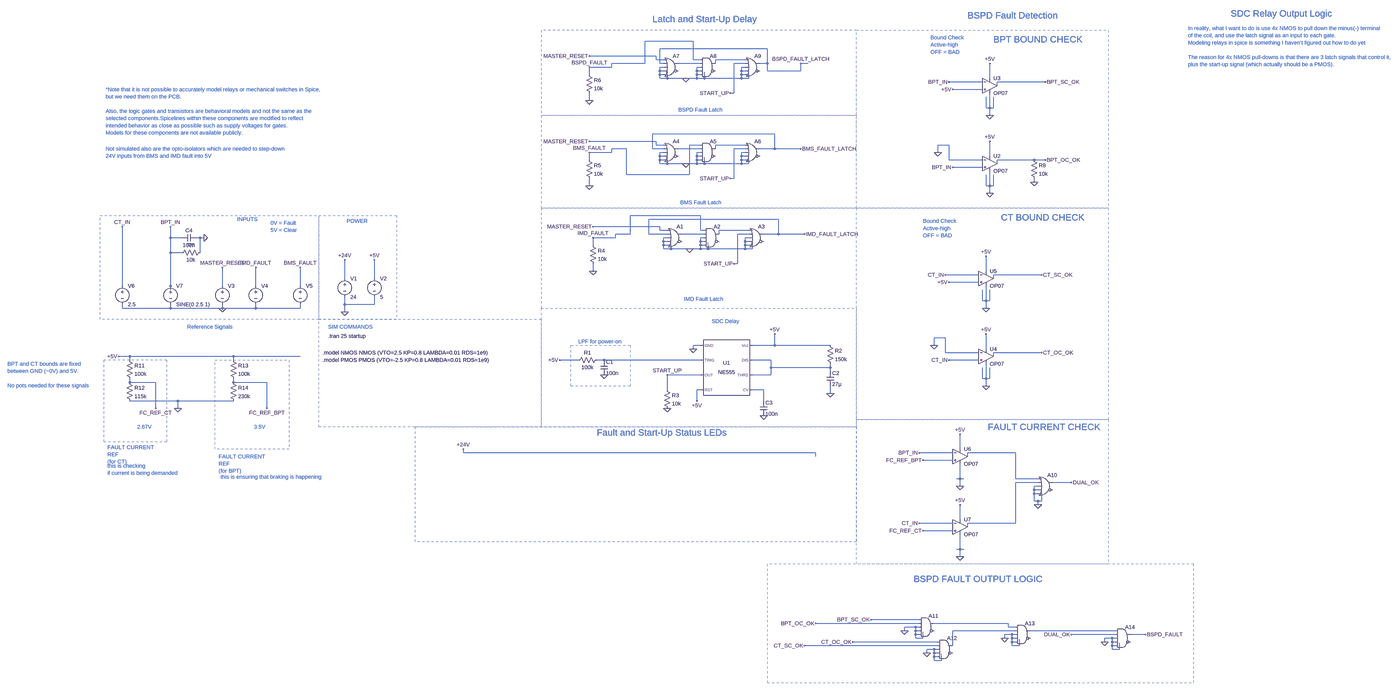
[diagram p0: schematic SDC_FULL_SIM.asc, whole sheet]
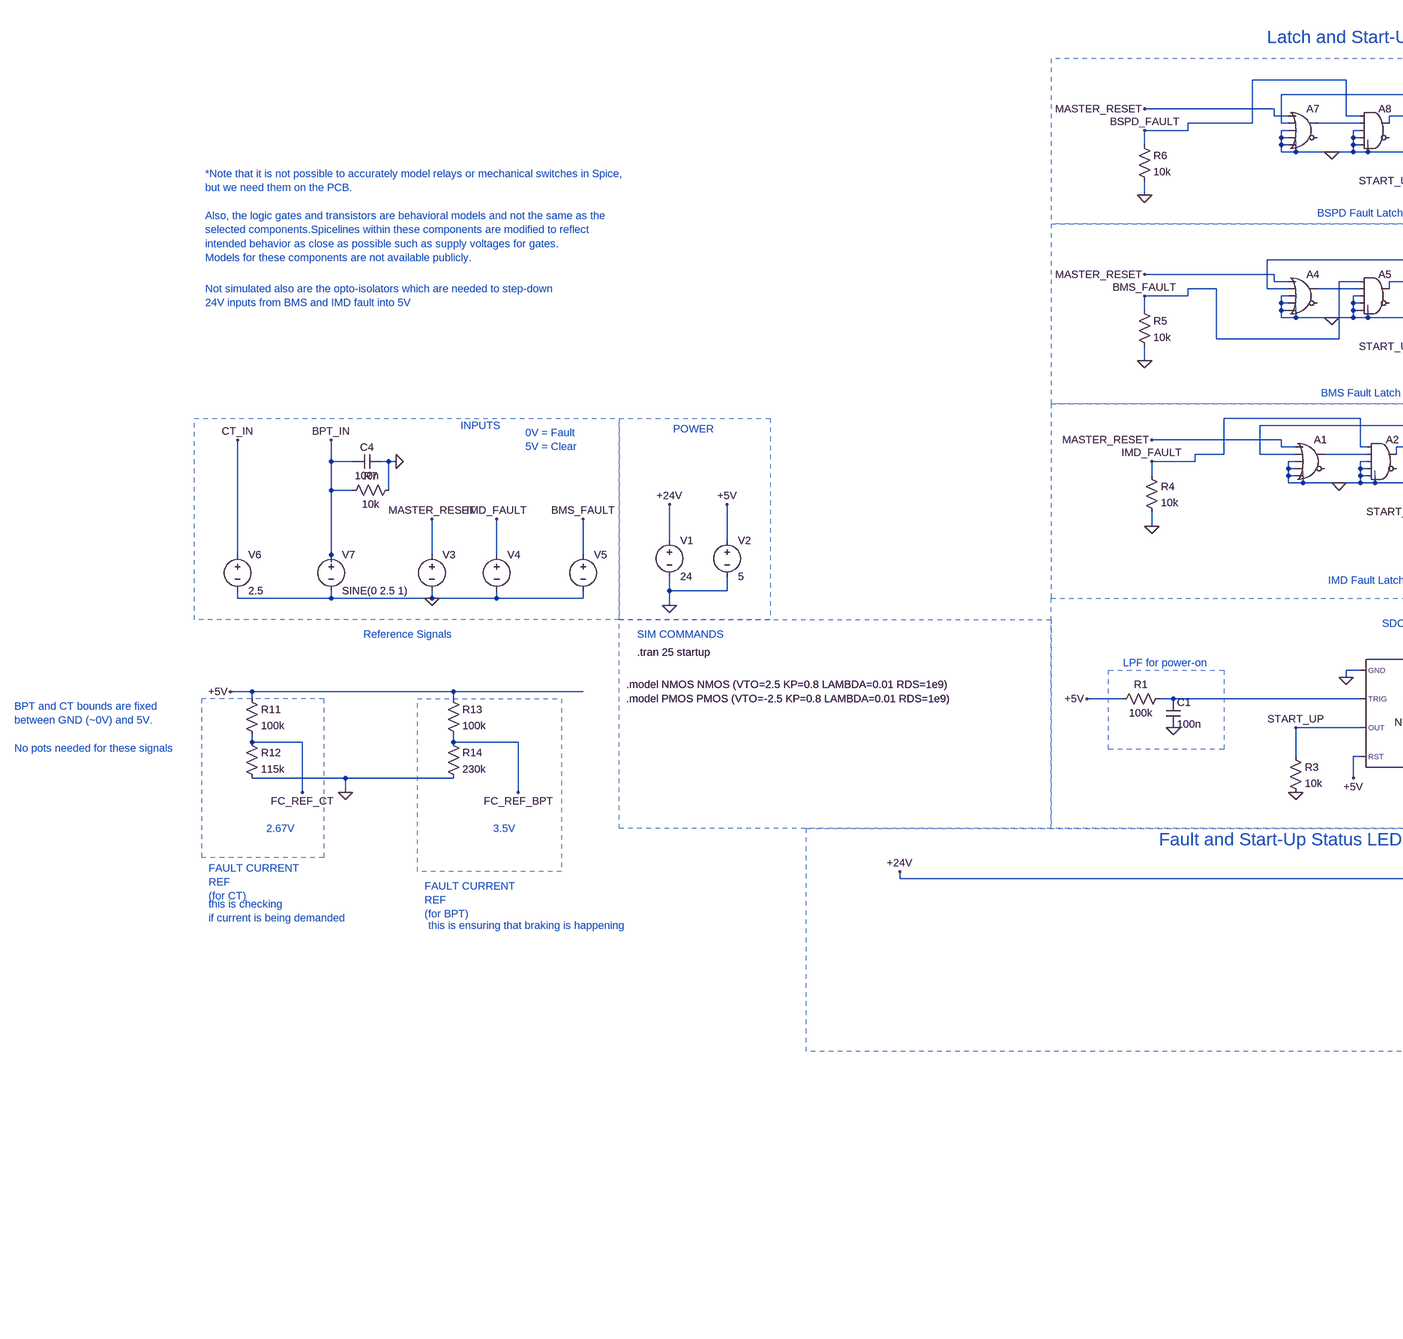
[diagram p1: schematic SDC_FULL_SIM.asc, part, row 1 of 1, column 1 of 2]
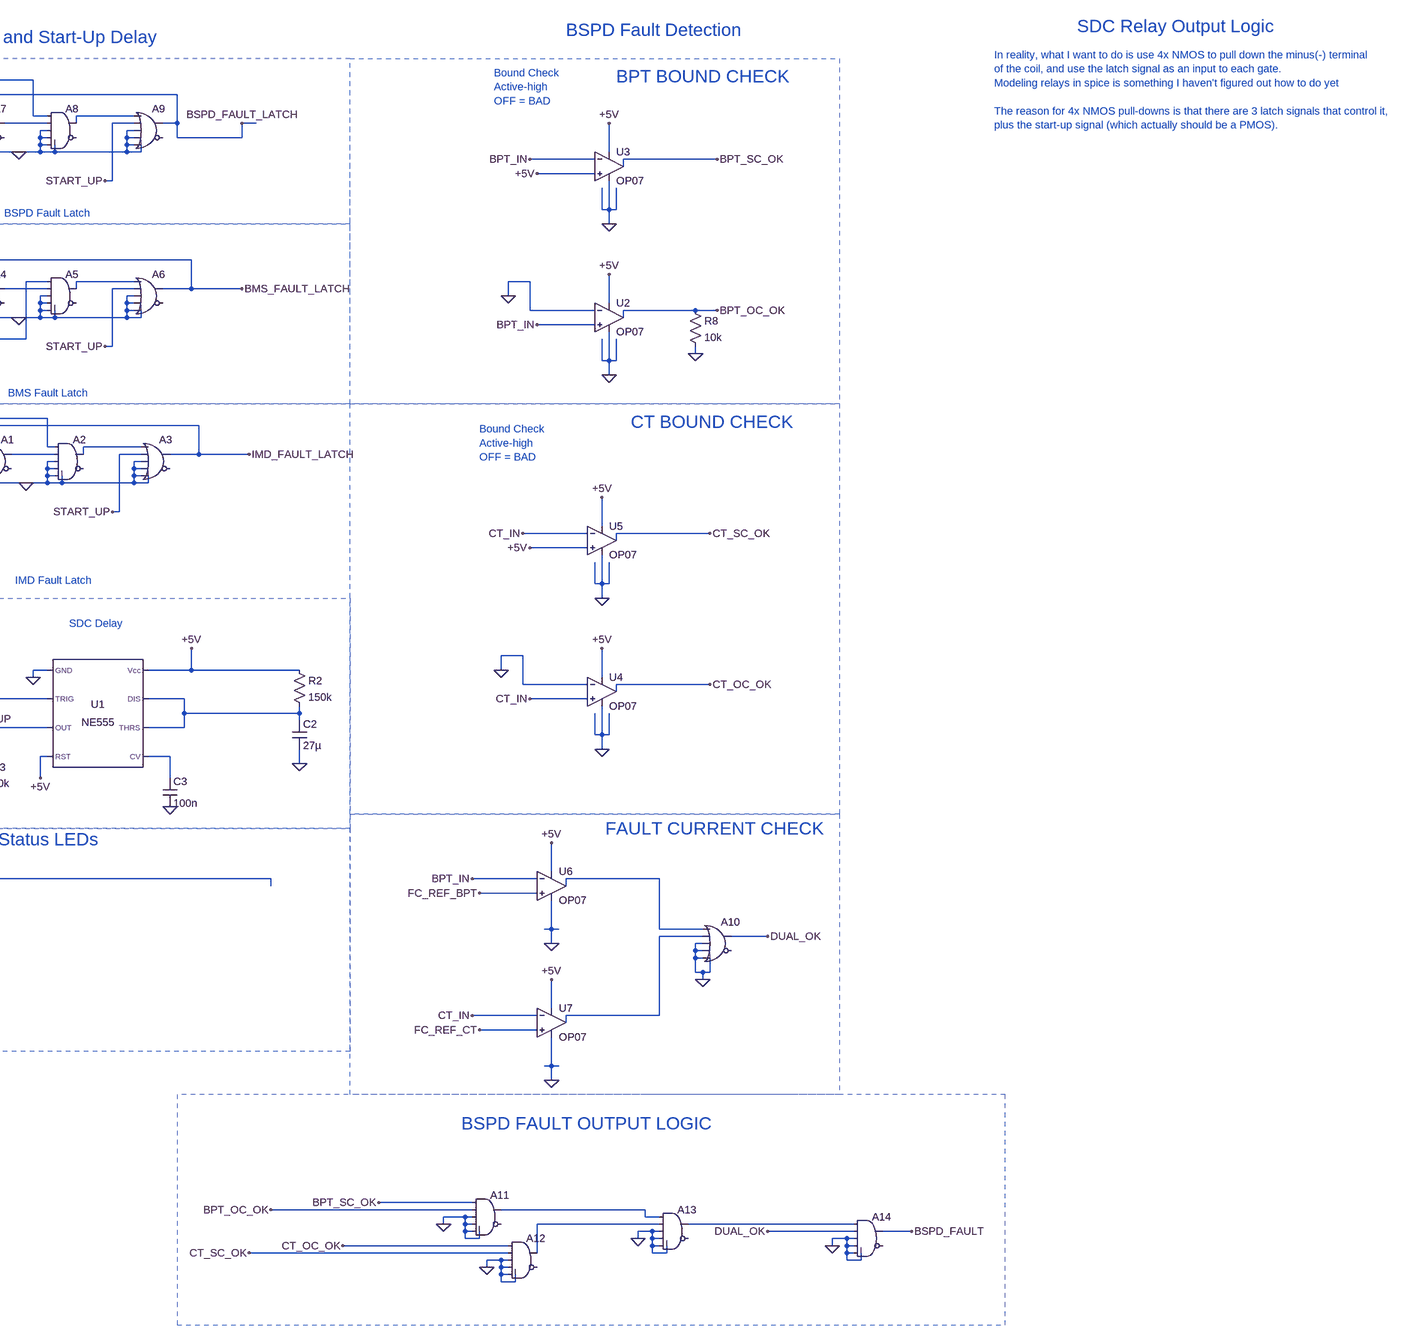
[diagram p2: schematic SDC_FULL_SIM.asc, part, row 1 of 1, column 2 of 2]
SDC_FULL_SIM.asc, the LTspice schematic file:
Version 4
SHEET 1 5196 1940
WIRE 800 -880 592 -880
WIRE 1120 -848 656 -848
WIRE 640 -816 352 -816
WIRE 640 -800 640 -816
WIRE 672 -800 640 -800
WIRE 800 -800 800 -880
WIRE 832 -800 800 -800
WIRE 1024 -800 896 -800
WIRE 592 -784 592 -880
WIRE 592 -784 448 -784
WIRE 656 -784 656 -848
WIRE 672 -784 656 -784
WIRE 832 -784 736 -784
WIRE 896 -784 896 -800
WIRE 1024 -784 976 -784
WIRE 1120 -784 1120 -848
WIRE 1120 -784 1088 -784
WIRE 1296 -784 1264 -784
WIRE 448 -768 448 -784
WIRE 448 -768 352 -768
WIRE 672 -768 656 -768
WIRE 832 -768 816 -768
WIRE 1024 -768 1008 -768
WIRE 656 -752 656 -768
WIRE 672 -752 656 -752
WIRE 816 -752 816 -768
WIRE 832 -752 816 -752
WIRE 1008 -752 1008 -768
WIRE 1024 -752 1008 -752
WIRE 1120 -752 1120 -784
WIRE 1264 -752 1264 -784
WIRE 1264 -752 1120 -752
WIRE 352 -736 352 -768
WIRE 656 -736 656 -752
WIRE 672 -736 656 -736
WIRE 816 -736 816 -752
WIRE 832 -736 816 -736
WIRE 1008 -736 1008 -752
WIRE 1024 -736 1008 -736
WIRE 656 -720 656 -736
WIRE 688 -720 688 -736
WIRE 688 -720 656 -720
WIRE 768 -720 688 -720
WIRE 816 -720 816 -736
WIRE 816 -720 768 -720
WIRE 848 -720 848 -736
WIRE 848 -720 816 -720
WIRE 1008 -720 1008 -736
WIRE 1008 -720 848 -720
WIRE 1040 -720 1040 -736
WIRE 1040 -720 1008 -720
WIRE 2080 -720 2080 -784
WIRE 2048 -704 1904 -704
WIRE 2320 -704 2112 -704
WIRE 2112 -688 2112 -704
WIRE 2048 -672 1920 -672
WIRE 976 -656 976 -784
WIRE 976 -656 960 -656
WIRE 352 -624 352 -656
WIRE 2064 -592 2064 -640
WIRE 2080 -592 2080 -656
WIRE 2080 -592 2064 -592
WIRE 2096 -592 2096 -640
WIRE 2096 -592 2080 -592
WIRE 2080 -560 2080 -592
WIRE 1152 -480 624 -480
WIRE 640 -448 352 -448
WIRE 640 -432 640 -448
WIRE 672 -432 640 -432
WIRE 832 -432 784 -432
WIRE 1024 -432 896 -432
WIRE 1904 -432 1856 -432
WIRE 512 -416 448 -416
WIRE 624 -416 624 -480
WIRE 672 -416 624 -416
WIRE 832 -416 736 -416
WIRE 896 -416 896 -432
WIRE 1024 -416 976 -416
WIRE 1152 -416 1152 -480
WIRE 1152 -416 1088 -416
WIRE 1264 -416 1152 -416
WIRE 448 -400 448 -416
WIRE 448 -400 352 -400
WIRE 672 -400 656 -400
WIRE 832 -400 816 -400
WIRE 1024 -400 1008 -400
WIRE 1856 -400 1856 -432
WIRE 656 -384 656 -400
WIRE 672 -384 656 -384
WIRE 816 -384 816 -400
WIRE 832 -384 816 -384
WIRE 1008 -384 1008 -400
WIRE 1024 -384 1008 -384
WIRE 2080 -384 2080 -448
WIRE 352 -368 352 -400
WIRE 656 -368 656 -384
WIRE 672 -368 656 -368
WIRE 816 -368 816 -384
WIRE 832 -368 816 -368
WIRE 1008 -368 1008 -384
WIRE 1024 -368 1008 -368
WIRE 1904 -368 1904 -432
WIRE 2048 -368 1904 -368
WIRE 2272 -368 2112 -368
WIRE 2320 -368 2272 -368
WIRE 656 -352 656 -368
WIRE 688 -352 688 -368
WIRE 688 -352 656 -352
WIRE 768 -352 688 -352
WIRE 816 -352 816 -368
WIRE 816 -352 768 -352
WIRE 848 -352 848 -368
WIRE 848 -352 816 -352
WIRE 1008 -352 1008 -368
WIRE 1008 -352 848 -352
WIRE 1040 -352 1040 -368
WIRE 1040 -352 1008 -352
WIRE 2112 -352 2112 -368
WIRE 2048 -336 1920 -336
WIRE 512 -304 512 -416
WIRE 784 -304 784 -432
WIRE 784 -304 512 -304
WIRE 976 -288 976 -416
WIRE 976 -288 960 -288
WIRE 2272 -272 2272 -288
WIRE 352 -256 352 -288
WIRE 2064 -256 2064 -304
WIRE 2080 -256 2080 -320
WIRE 2080 -256 2064 -256
WIRE 2096 -256 2096 -304
WIRE 2096 -256 2080 -256
WIRE 2080 -224 2080 -256
WIRE 832 -128 528 -128
WIRE 1168 -112 608 -112
WIRE 656 -80 368 -80
WIRE 656 -64 656 -80
WIRE 688 -64 656 -64
WIRE 832 -64 832 -128
WIRE 848 -64 832 -64
WIRE 1040 -64 912 -64
WIRE 528 -48 528 -128
WIRE 528 -48 464 -48
WIRE 608 -48 608 -112
WIRE 688 -48 608 -48
WIRE 848 -48 752 -48
WIRE 912 -48 912 -64
WIRE 1040 -48 992 -48
WIRE 1168 -48 1168 -112
WIRE 1168 -48 1104 -48
WIRE 1280 -48 1168 -48
WIRE -1456 -32 -1456 -80
WIRE -1408 -32 -1456 -32
WIRE -1328 -32 -1344 -32
WIRE -1312 -32 -1328 -32
WIRE 464 -32 464 -48
WIRE 464 -32 368 -32
WIRE 688 -32 672 -32
WIRE 848 -32 832 -32
WIRE 1040 -32 1024 -32
WIRE 672 -16 672 -32
WIRE 688 -16 672 -16
WIRE 832 -16 832 -32
WIRE 848 -16 832 -16
WIRE 1024 -16 1024 -32
WIRE 1040 -16 1024 -16
WIRE 368 0 368 -32
WIRE 672 0 672 -16
WIRE 688 0 672 0
WIRE 832 0 832 -16
WIRE 848 0 832 0
WIRE 1024 0 1024 -16
WIRE 1040 0 1024 0
WIRE 672 16 672 0
WIRE 704 16 704 0
WIRE 704 16 672 16
WIRE 784 16 704 16
WIRE 832 16 832 0
WIRE 832 16 784 16
WIRE 864 16 864 0
WIRE 864 16 832 16
WIRE 1024 16 1024 0
WIRE 1024 16 864 16
WIRE 1056 16 1056 0
WIRE 1056 16 1024 16
WIRE -1456 32 -1456 -32
WIRE -1408 32 -1456 32
WIRE -1328 32 -1328 -32
WIRE 992 80 992 -48
WIRE 992 80 976 80
WIRE 368 112 368 80
WIRE 2064 112 2064 48
WIRE 2032 128 1888 128
WIRE 2304 128 2096 128
WIRE -704 144 -704 64
WIRE -576 144 -576 64
WIRE 2096 144 2096 128
WIRE 2032 160 1904 160
WIRE -1664 176 -1664 -80
WIRE -1456 176 -1456 32
WIRE -1232 176 -1232 96
WIRE -1088 176 -1088 96
WIRE -896 176 -896 96
WIRE -1456 192 -1456 176
WIRE 2048 240 2048 192
WIRE 2064 240 2064 176
WIRE 2064 240 2048 240
WIRE 2080 240 2080 192
WIRE 2080 240 2064 240
WIRE -704 256 -704 224
WIRE -576 256 -576 224
WIRE -576 256 -704 256
WIRE -1664 272 -1664 256
WIRE -1456 272 -1456 256
WIRE -1456 272 -1664 272
WIRE -1232 272 -1232 256
WIRE -1232 272 -1456 272
WIRE -1088 272 -1088 256
WIRE -1088 272 -1232 272
WIRE -896 272 -896 256
WIRE -896 272 -1088 272
WIRE 2064 272 2064 240
WIRE -704 288 -704 256
WIRE 1888 400 1840 400
WIRE 832 432 800 432
WIRE 1152 432 1152 384
WIRE 1152 432 1056 432
WIRE 1392 432 1152 432
WIRE 1840 432 1840 400
WIRE 800 448 800 432
WIRE 2064 448 2064 384
WIRE 1888 464 1888 400
WIRE 2032 464 1888 464
WIRE 2304 464 2096 464
WIRE -1632 480 -1680 480
WIRE -1184 480 -1632 480
WIRE -896 480 -1184 480
WIRE 2096 480 2096 464
WIRE -1632 496 -1632 480
WIRE -1184 496 -1184 480
WIRE 304 496 224 496
WIRE 416 496 384 496
WIRE 832 496 416 496
WIRE 1136 496 1056 496
WIRE 2032 496 1904 496
WIRE 1136 528 1136 496
WIRE 1392 528 1392 512
WIRE 1392 528 1136 528
WIRE 1392 544 1392 528
WIRE 832 560 688 560
WIRE 1136 560 1136 528
WIRE 1136 560 1056 560
WIRE 2048 576 2048 528
WIRE 2064 576 2064 512
WIRE 2064 576 2048 576
WIRE 2080 576 2080 528
WIRE 2080 576 2064 576
WIRE -1632 592 -1632 576
WIRE -1520 592 -1632 592
WIRE -1184 592 -1184 576
WIRE -1040 592 -1184 592
WIRE 2064 608 2064 576
WIRE 688 624 688 560
WIRE 832 624 816 624
WIRE 1104 624 1056 624
WIRE 1392 640 1392 608
WIRE -1424 672 -1632 672
WIRE -1184 672 -1424 672
WIRE 816 672 816 624
WIRE 1104 672 1104 624
WIRE -1520 704 -1520 592
WIRE -1424 704 -1424 672
WIRE -1040 704 -1040 592
WIRE 1952 880 1952 816
WIRE -192 896 -192 880
WIRE 1328 896 -192 896
WIRE 1920 896 1776 896
WIRE 2192 896 1984 896
WIRE 1328 912 1328 896
WIRE 1984 912 1984 896
WIRE 1920 928 1792 928
WIRE 1952 1008 1952 944
WIRE 1952 1008 1936 1008
WIRE 1968 1008 1952 1008
WIRE 2192 1008 2192 896
WIRE 2288 1008 2192 1008
WIRE 2288 1024 2192 1024
WIRE 2432 1024 2352 1024
WIRE 1952 1040 1952 1008
WIRE 2288 1040 2272 1040
WIRE 2272 1056 2272 1040
WIRE 2288 1056 2272 1056
WIRE 2272 1072 2272 1056
WIRE 2288 1072 2272 1072
WIRE 2272 1104 2272 1072
WIRE 2288 1104 2272 1104
WIRE 2304 1104 2304 1072
WIRE 2304 1104 2288 1104
WIRE 2288 1120 2288 1104
WIRE 1952 1184 1952 1120
WIRE 1920 1200 1776 1200
WIRE 2192 1200 2192 1024
WIRE 2192 1200 1984 1200
WIRE 1984 1216 1984 1200
WIRE 1920 1232 1792 1232
WIRE 1952 1312 1952 1248
WIRE 1952 1312 1936 1312
WIRE 1968 1312 1952 1312
WIRE 1952 1344 1952 1312
WIRE 1776 1616 1568 1616
WIRE 1776 1632 1328 1632
WIRE 2160 1632 1840 1632
WIRE 1760 1648 1712 1648
WIRE 1776 1648 1760 1648
WIRE 2160 1648 2160 1632
WIRE 2192 1648 2160 1648
WIRE 1712 1664 1712 1648
WIRE 1760 1664 1760 1648
WIRE 1776 1664 1760 1664
WIRE 2192 1664 1920 1664
WIRE 2624 1664 2256 1664
WIRE 1760 1680 1760 1664
WIRE 1776 1680 1760 1680
WIRE 2176 1680 2144 1680
WIRE 2192 1680 2176 1680
WIRE 2624 1680 2432 1680
WIRE 2752 1680 2688 1680
WIRE 1760 1696 1760 1680
WIRE 1792 1696 1792 1680
WIRE 1792 1696 1760 1696
WIRE 2144 1696 2144 1680
WIRE 2176 1696 2176 1680
WIRE 2192 1696 2176 1696
WIRE 2608 1696 2576 1696
WIRE 2624 1696 2608 1696
WIRE 1856 1712 1488 1712
WIRE 2176 1712 2176 1696
WIRE 2192 1712 2176 1712
WIRE 2576 1712 2576 1696
WIRE 2608 1712 2608 1696
WIRE 2624 1712 2608 1712
WIRE 1856 1728 1280 1728
WIRE 1920 1728 1920 1664
WIRE 2176 1728 2176 1712
WIRE 2208 1728 2208 1712
WIRE 2208 1728 2176 1728
WIRE 2608 1728 2608 1712
WIRE 2624 1728 2608 1728
WIRE 1840 1744 1808 1744
WIRE 1856 1744 1840 1744
WIRE 2608 1744 2608 1728
WIRE 2640 1744 2640 1728
WIRE 2640 1744 2608 1744
WIRE 1808 1760 1808 1744
WIRE 1840 1760 1840 1744
WIRE 1856 1760 1840 1760
WIRE 1840 1776 1840 1760
WIRE 1856 1776 1840 1776
WIRE 1840 1792 1840 1776
WIRE 1872 1792 1872 1776
WIRE 1872 1792 1840 1792
FLAG -704 288 0
FLAG -704 64 +24V
FLAG -576 64 +5V
FLAG 800 448 0
FLAG 416 560 0
FLAG 688 560 START_UP
FLAG 1392 640 0
FLAG 688 704 0
FLAG 1104 736 0
FLAG 368 112 0
FLAG -1232 96 MASTER_RESET
FLAG 368 -32 IMD_FAULT
FLAG -896 96 BMS_FAULT
FLAG -1088 96 IMD_FAULT
FLAG 368 -80 MASTER_RESET
FLAG 976 80 START_UP
FLAG 1280 -48 IMD_FAULT_LATCH
FLAG 784 16 0
FLAG 352 -256 0
FLAG 352 -448 MASTER_RESET
FLAG 960 -288 START_UP
FLAG 768 -352 0
FLAG 352 -400 BMS_FAULT
FLAG 1264 -416 BMS_FAULT_LATCH
FLAG 352 -624 0
FLAG 352 -816 MASTER_RESET
FLAG 960 -656 START_UP
FLAG 768 -720 0
FLAG 352 -768 BSPD_FAULT
FLAG 1264 -784 BSPD_FAULT_LATCH
FLAG -192 880 +24V
FLAG -1456 -80 BPT_IN
FLAG -1664 -80 CT_IN
FLAG -1232 272 0
FLAG -1680 480 +5V
FLAG -1424 704 0
FLAG -1520 704 FC_REF_CT
FLAG 2080 -560 0
FLAG 2080 -784 +5V
FLAG 1904 -704 BPT_IN
FLAG 1920 -672 +5V
FLAG 2320 -704 BPT_SC_OK
FLAG 2080 -224 0
FLAG 2080 -448 +5V
FLAG 1920 -336 BPT_IN
FLAG 2320 -368 BPT_OC_OK
FLAG 1856 -400 0
FLAG 2064 272 0
FLAG 2064 48 +5V
FLAG 1888 128 CT_IN
FLAG 1904 160 +5V
FLAG 2304 128 CT_SC_OK
FLAG 2064 608 0
FLAG 2064 384 +5V
FLAG 1904 496 CT_IN
FLAG 2304 464 CT_OC_OK
FLAG 1840 432 0
FLAG -1040 704 FC_REF_BPT
FLAG 1952 1040 0
FLAG 1952 816 +5V
FLAG 1776 896 BPT_IN
FLAG 1952 1344 0
FLAG 1952 1120 +5V
FLAG 1776 1200 CT_IN
FLAG 1792 928 FC_REF_BPT
FLAG 1792 1232 FC_REF_CT
FLAG 2288 1120 0
FLAG 2432 1024 DUAL_OK
FLAG 1568 1616 BPT_SC_OK
FLAG 1328 1632 BPT_OC_OK
FLAG 1280 1728 CT_SC_OK
FLAG 1488 1712 CT_OC_OK
FLAG 2432 1680 DUAL_OK
FLAG 2752 1680 BSPD_FAULT
FLAG 1712 1664 0
FLAG 1808 1760 0
FLAG 2144 1696 0
FLAG 2576 1712 0
FLAG 816 672 +5V
FLAG 1152 384 +5V
FLAG 224 496 +5V
FLAG -1312 -32 0
FLAG 2272 -272 0
SYMBOL Misc\\NE555 944 528 R0
SYMATTR InstName U1
SYMBOL voltage -704 128 R0
WINDOW 123 0 0 Left 0
WINDOW 39 0 0 Left 0
SYMATTR InstName V1
SYMATTR Value 24
SYMBOL voltage -576 128 R0
WINDOW 123 0 0 Left 0
WINDOW 39 0 0 Left 0
SYMATTR InstName V2
SYMATTR Value 5
SYMBOL res 400 480 R90
WINDOW 0 0 56 VBottom 2
WINDOW 3 32 56 VTop 2
SYMATTR InstName R1
SYMATTR Value 100k
SYMBOL cap 400 496 R0
SYMATTR InstName C1
SYMATTR Value 100n
SYMBOL res 1376 416 R0
SYMATTR InstName R2
SYMATTR Value 150k
SYMBOL cap 1376 544 R0
SYMATTR InstName C2
SYMATTR Value 27µ
SYMBOL res 672 608 R0
SYMATTR InstName R3
SYMATTR Value 10k
SYMBOL cap 1088 672 R0
SYMATTR InstName C3
SYMATTR Value 100n
SYMBOL res 352 -16 R0
SYMATTR InstName R4
SYMATTR Value 10k
SYMBOL Digital\\or 720 -96 R0
SYMATTR InstName A1
SYMATTR SpiceLine Vhigh=5, Vlow=0, Ref= 2.5
SYMBOL Digital\\and 880 -96 R0
SYMATTR InstName A2
SYMATTR SpiceLine Vhigh=5, Vlow=0, Ref= 2.5
SYMBOL Digital\\or 1072 -96 R0
SYMATTR InstName A3
SYMATTR SpiceLine Vhigh=5, Vlow=0, Ref= 2.5
SYMBOL voltage -1232 160 R0
WINDOW 3 -400 -182 Invisible 2
WINDOW 123 0 0 Left 0
WINDOW 39 0 0 Left 0
SYMATTR Value PULSE(0 5 7 0 0 2 30 1)
SYMATTR InstName V3
SYMBOL voltage -896 160 R0
WINDOW 3 -400 -182 Invisible 2
WINDOW 123 0 0 Left 0
WINDOW 39 0 0 Left 0
SYMATTR Value 5
SYMATTR InstName V5
SYMBOL res 336 -384 R0
SYMATTR InstName R5
SYMATTR Value 10k
SYMBOL Digital\\or 704 -464 R0
SYMATTR InstName A4
SYMATTR SpiceLine Vhigh=5, Vlow=0, Ref= 2.5
SYMBOL Digital\\and 864 -464 R0
SYMATTR InstName A5
SYMATTR SpiceLine Vhigh=5, Vlow=0, Ref= 2.5
SYMBOL Digital\\or 1056 -464 R0
SYMATTR InstName A6
SYMATTR SpiceLine Vhigh=5, Vlow=0, Ref= 2.5
SYMBOL res 336 -752 R0
SYMATTR InstName R6
SYMATTR Value 10k
SYMBOL Digital\\or 704 -832 R0
SYMATTR InstName A7
SYMATTR SpiceLine Vhigh=5, Vlow=0, Ref= 2.5
SYMBOL Digital\\and 864 -832 R0
SYMATTR InstName A8
SYMATTR SpiceLine Vhigh=5, Vlow=0, Ref= 2.5
SYMBOL Digital\\or 1056 -832 R0
SYMATTR InstName A9
SYMATTR SpiceLine Vhigh=5, Vlow=0, Ref= 2.5
SYMBOL voltage -1664 160 R0
WINDOW 123 0 0 Left 0
WINDOW 39 0 0 Left 0
SYMATTR InstName V6
SYMATTR Value 2.5
SYMBOL voltage -1456 160 R0
WINDOW 123 0 0 Left 0
WINDOW 39 0 0 Left 0
SYMATTR InstName V7
SYMATTR Value SINE(0 2.5 1)
SYMBOL res -1648 480 R0
SYMATTR InstName R11
SYMATTR Value 100k
SYMBOL res -1648 576 R0
SYMATTR InstName R12
SYMATTR Value 115k
SYMBOL res -1200 480 R0
SYMATTR InstName R13
SYMATTR Value 100k
SYMBOL res -1200 576 R0
SYMATTR InstName R14
SYMATTR Value 230k
SYMBOL Digital\\or 2320 976 R0
SYMATTR InstName A10
SYMATTR SpiceLine Vhigh=5, Vlow=0, Ref= 2.5
SYMBOL Digital\\and 1808 1584 R0
SYMATTR InstName A11
SYMATTR SpiceLine Vhigh=5, Vlow=0, Ref= 2.5
SYMBOL Digital\\and 1888 1680 R0
SYMATTR InstName A12
SYMATTR SpiceLine Vhigh=5, Vlow=0, Ref= 2.5
SYMBOL Digital\\and 2224 1616 R0
SYMATTR InstName A13
SYMATTR SpiceLine Vhigh=5, Vlow=0, Ref= 2.5
SYMBOL Digital\\and 2656 1632 R0
SYMATTR InstName A14
SYMATTR SpiceLine Vhigh=5, Vlow=0, Ref= 2.5
SYMBOL OpAmps\\OP07 1952 1152 R0
SYMATTR InstName U7
SYMBOL OpAmps\\OP07 1952 848 R0
SYMATTR InstName U6
SYMBOL OpAmps\\OP07 2064 416 R0
SYMATTR InstName U4
SYMBOL OpAmps\\OP07 2064 80 R0
SYMATTR InstName U5
SYMBOL OpAmps\\OP07 2080 -416 R0
SYMATTR InstName U2
SYMBOL OpAmps\\OP07 2080 -752 R0
SYMATTR InstName U3
SYMBOL voltage -1088 160 R0
WINDOW 3 -400 -182 Invisible 2
WINDOW 123 0 0 Left 0
WINDOW 39 0 0 Left 0
SYMATTR Value 5
SYMATTR InstName V4
SYMBOL cap -1344 -48 R90
WINDOW 0 0 32 VBottom 2
WINDOW 3 32 32 VTop 2
SYMATTR InstName C4
SYMATTR Value 100n
SYMBOL res -1312 16 R90
WINDOW 0 0 56 VBottom 2
WINDOW 3 32 56 VTop 2
SYMATTR InstName R7
SYMATTR Value 10k
SYMBOL res 2256 -384 R0
SYMATTR InstName R8
SYMATTR Value 10k
TEXT -696 -104 Left 2 ;POWER
TEXT 880 328 Left 2 ;SDC Delay
TEXT -776 352 Left 2 ;SIM COMMANDS
TEXT -776 392 Left 2 !.tran 25 startup
TEXT 304 416 Left 2 ;LPF for power-on
TEXT 760 232 Left 2 ;IMD Fault Latch
TEXT -1168 -112 Left 2 ;INPUTS
TEXT 744 -184 Left 2 ;BMS Fault Latch
TEXT 736 -584 Left 2 ;BSPD Fault Latch
TEXT 624 -976 Left 4 ;Latch and Start-Up Delay
TEXT 1984 -992 Left 4 ;BSPD Fault Detection
TEXT 3120 -1000 Left 4 ;SDC Relay Output Logic
TEXT -1736 -672 Left 2 ;*Note that it is not possible to accurately model relays or mechanical switches in Spice,\nbut we need them on the PCB.\n \nAlso, the logic gates and transistors are behavioral models and not the same as the \nselected components.Spicelines within these components are modified to reflect \nintended behavior as close as possible such as supply voltages for gates. \nModels for these components are not available publicly.
TEXT 384 808 Left 4 ;Fault and Start-Up Status LEDs
TEXT -1384 352 Left 2 ;Reference Signals
TEXT -1728 872 Left 2 ;FAULT CURRENT\nREF\n(for CT)
TEXT -1736 -416 Left 2 ;Not simulated also are the opto-isolators which are needed to step-down\n24V inputs from BMS and IMD fault into 5V
TEXT -2160 512 Left 2 ;BPT and CT bounds are fixed \nbetween GND (~0V) and 5V.\n \nNo pots needed for these signals
TEXT 1824 -896 Left 2 ;Bound Check\nActive-high\nOFF = BAD
TEXT 2096 -888 Left 4 ;BPT BOUND CHECK
TEXT 2128 -120 Left 4 ;CT BOUND CHECK
TEXT -1248 912 Left 2 ;FAULT CURRENT\nREF\n(for BPT)
TEXT -1096 784 Left 2 ;3.5V
TEXT -1600 784 Left 2 ;2.67V
TEXT 2072 784 Left 4 ;FAULT CURRENT CHECK
TEXT 1752 1440 Left 4 ;BSPD FAULT OUTPUT LOGIC
TEXT -800 464 Left 2 !.model NMOS NMOS (VTO=2.5 KP=0.8 LAMBDA=0.01 RDS=1e9)
TEXT -800 496 Left 2 !.model PMOS PMOS (VTO=-2.5 KP=0.8 LAMBDA=0.01 RDS=1e9)
TEXT 2936 -936 Left 2 ;In reality, what I want to do is use 4x NMOS to pull down the minus(-) terminal\nof the coil, and use the latch signal as an input to each gate. \nModeling relays in spice is something I haven't figured out how to do yet\n \nThe reason for 4x NMOS pull-downs is that there are 3 latch signals that control it,\nplus the start-up signal (which actually should be a PMOS).
TEXT -1240 1000 Left 2 ;this is ensuring that braking is happening
TEXT -1728 952 Left 2 ;this is checking \nif current is being demanded
TEXT 1792 -104 Left 2 ;Bound Check\nActive-high\nOFF = BAD
TEXT -1024 -96 Left 2 ;0V = Fault\n5V = Clear
RECTANGLE Normal -480 320 -816 -128 2
RECTANGLE Normal 528 608 272 432 2
RECTANGLE Normal 1504 784 144 272 2
RECTANGLE Normal 1504 -160 144 272 2
RECTANGLE Normal 1504 -560 144 -160 2
RECTANGLE Normal 1504 -928 144 -560 2
RECTANGLE Normal 1504 1280 -400 784 2
RECTANGLE Normal -1760 -128 -816 320 2
RECTANGLE Normal -1744 848 -1472 496 2
RECTANGLE Normal 2592 -160 1504 -928 2
RECTANGLE Normal 2592 752 1504 -160 2
RECTANGLE Normal -944 880 -1264 496 2
RECTANGLE Normal 2592 1376 1504 752 2
RECTANGLE Normal 1120 1888 2960 1376 2
RECTANGLE Normal 144 784 -816 320 2

The netlist it stands for:
* SDC_FULL_SIM.asc
XU1 0 N007 START_UP +5V N009 N008 N008 +5V NE555  ; pins GND TRIG OUT RST CV THRS DIS Vcc
V1 +24V 0 24
V2 +5V 0 5
R1 N007 +5V 100k
C1 N007 0 100n
R2 +5V N008 150k
C2 N008 0 27µ
R3 START_UP 0 10k
C3 N009 0 100n
R4 IMD_FAULT 0 10k
A1 MASTER_RESET IMD_FAULT_LATCH 0 0 0 0 N006 0 OR Vhigh=5, Vlow=0, Ref= 2.5
A2 IMD_FAULT N006 0 0 0 0 N005 0 AND Vhigh=5, Vlow=0, Ref= 2.5
A3 N005 START_UP 0 0 0 0 IMD_FAULT_LATCH 0 OR Vhigh=5, Vlow=0, Ref= 2.5
V3 MASTER_RESET 0 PULSE(0 5 7 0 0 2 30 1)
V5 BMS_FAULT 0 5
R5 BMS_FAULT 0 10k
A4 MASTER_RESET BMS_FAULT_LATCH 0 0 0 0 N004 0 OR Vhigh=5, Vlow=0, Ref= 2.5
A5 BMS_FAULT N004 0 0 0 0 N003 0 AND Vhigh=5, Vlow=0, Ref= 2.5
A6 N003 START_UP 0 0 0 0 BMS_FAULT_LATCH 0 OR Vhigh=5, Vlow=0, Ref= 2.5
R6 BSPD_FAULT 0 10k
A7 MASTER_RESET BSPD_FAULT_LATCH 0 0 0 0 N002 0 OR Vhigh=5, Vlow=0, Ref= 2.5
A8 BSPD_FAULT N002 0 0 0 0 N001 0 AND Vhigh=5, Vlow=0, Ref= 2.5
A9 N001 START_UP 0 0 0 0 BSPD_FAULT_LATCH 0 OR Vhigh=5, Vlow=0, Ref= 2.5
V6 CT_IN 0 2.5
V7 BPT_IN 0 SINE(0 2.5 1)
R11 +5V FC_REF_CT 100k
R12 FC_REF_CT 0 115k
R13 +5V FC_REF_BPT 100k
R14 FC_REF_BPT 0 230k
A10 N010 N011 0 0 0 0 DUAL_OK 0 OR Vhigh=5, Vlow=0, Ref= 2.5
A11 BPT_SC_OK BPT_OC_OK 0 0 0 0 N012 0 AND Vhigh=5, Vlow=0, Ref= 2.5
A12 CT_OC_OK CT_SC_OK 0 0 0 0 N013 0 AND Vhigh=5, Vlow=0, Ref= 2.5
A13 N012 N013 0 0 0 0 N014 0 AND Vhigh=5, Vlow=0, Ref= 2.5
A14 N014 DUAL_OK 0 0 0 0 BSPD_FAULT 0 AND Vhigh=5, Vlow=0, Ref= 2.5
XU7 FC_REF_CT CT_IN +5V 0 N011 LT1001  ; OP07, pins In+ In- V+ V- OUT
XU6 FC_REF_BPT BPT_IN +5V 0 N010 LT1001  ; OP07, pins In+ In- V+ V- OUT
XU4 CT_IN 0 +5V 0 CT_OC_OK LT1001  ; OP07, pins In+ In- V+ V- OUT
XU5 +5V CT_IN +5V 0 CT_SC_OK LT1001  ; OP07, pins In+ In- V+ V- OUT
XU2 BPT_IN 0 +5V 0 BPT_OC_OK LT1001  ; OP07, pins In+ In- V+ V- OUT
XU3 +5V BPT_IN +5V 0 BPT_SC_OK LT1001  ; OP07, pins In+ In- V+ V- OUT
V4 IMD_FAULT 0 5
C4 0 BPT_IN 100n
R7 0 BPT_IN 10k
R8 BPT_OC_OK 0 10k
* POWER
* SDC Delay
* SIM COMMANDS
.tran 25 startup
* LPF for power-on
* IMD Fault Latch
* INPUTS
* BMS Fault Latch
* BSPD Fault Latch
* Latch and Start-Up Delay
* BSPD Fault Detection
* SDC Relay Output Logic
* *Note that it is not possible to accurately model relays or mechanical switches in Spice,
* but we need them on the PCB.
* Also, the logic gates and transistors are behavioral models and not the same as the
* selected components.Spicelines within these components are modified to reflect
* intended behavior as close as possible such as supply voltages for gates.
* Models for these components are not available publicly.
* Fault and Start-Up Status LEDs
* Reference Signals
* FAULT CURRENT
* REF
* (for CT)
* Not simulated also are the opto-isolators which are needed to step-down
* 24V inputs from BMS and IMD fault into 5V
* BPT and CT bounds are fixed
* between GND (~0V) and 5V.
* No pots needed for these signals
* Bound Check
* Active-high
* OFF = BAD
* BPT BOUND CHECK
* CT BOUND CHECK
* FAULT CURRENT
* REF
* (for BPT)
* 3.5V
* 2.67V
* FAULT CURRENT CHECK
* BSPD FAULT OUTPUT LOGIC
.model NMOS NMOS (VTO=2.5 KP=0.8 LAMBDA=0.01 RDS=1e9)
.model PMOS PMOS (VTO=-2.5 KP=0.8 LAMBDA=0.01 RDS=1e9)
* In reality, what I want to do is use 4x NMOS to pull down the minus(-) terminal
* of the coil, and use the latch signal as an input to each gate.
* Modeling relays in spice is something I haven't figured out how to do yet
* The reason for 4x NMOS pull-downs is that there are 3 latch signals that control it,
* plus the start-up signal (which actually should be a PMOS).
* this is ensuring that braking is happening
* this is checking
* if current is being demanded
* Bound Check
* Active-high
* OFF = BAD
* 0V = Fault
* 5V = Clear
.lib NE555.sub
.lib LTC.lib
.backanno
.end